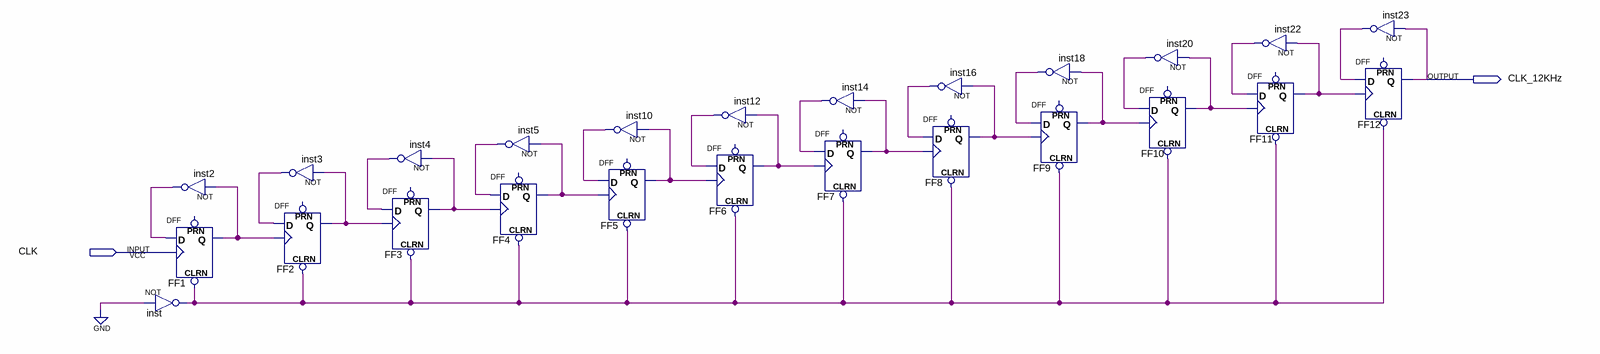
[diagram p0: schematic sheet]
// Quartus schematic CLK_12KHz.bdf as structural Verilog: 25 symbols, 2 pins
module CLK_12KHz (
  input  CLK,
  output CLK_12KHz
);

  wire FF1_q, FF2_q, FF3_q, FF4_q, FF5_q, FF6_q, FF7_q, FF8_q, FF9_q, FF10_q, FF11_q, inst2_out, inst3_out,
       inst4_out, inst5_out, inst10_out, inst12_out, inst14_out, inst16_out, inst18_out, inst20_out,
       inst22_out, inst23_out, inst_out;

  not inst (inst_out, 1'b0);
  not inst2 (inst2_out, FF1_q);
  DFF FF1 (.CLRN(inst_out), .CLK(CLK), .D(inst2_out), .Q(FF1_q));  // open: PRN
  not inst3 (inst3_out, FF2_q);
  DFF FF2 (.CLRN(inst_out), .CLK(FF1_q), .D(inst3_out), .Q(FF2_q));  // open: PRN
  not inst4 (inst4_out, FF3_q);
  DFF FF3 (.CLRN(inst_out), .CLK(FF2_q), .D(inst4_out), .Q(FF3_q));  // open: PRN
  DFF FF4 (.CLRN(inst_out), .CLK(FF3_q), .D(inst5_out), .Q(FF4_q));  // open: PRN
  not inst5 (inst5_out, FF4_q);
  not inst10 (inst10_out, FF5_q);
  DFF FF5 (.CLRN(inst_out), .CLK(FF4_q), .D(inst10_out), .Q(FF5_q));  // open: PRN
  not inst12 (inst12_out, FF6_q);
  DFF FF6 (.CLRN(inst_out), .CLK(FF5_q), .D(inst12_out), .Q(FF6_q));  // open: PRN
  not inst14 (inst14_out, FF7_q);
  DFF FF7 (.CLRN(inst_out), .CLK(FF6_q), .D(inst14_out), .Q(FF7_q));  // open: PRN
  not inst16 (inst16_out, FF8_q);
  DFF FF8 (.CLRN(inst_out), .CLK(FF7_q), .D(inst16_out), .Q(FF8_q));  // open: PRN
  not inst18 (inst18_out, FF9_q);
  DFF FF9 (.CLRN(inst_out), .CLK(FF8_q), .D(inst18_out), .Q(FF9_q));  // open: PRN
  not inst20 (inst20_out, FF10_q);
  DFF FF10 (.CLRN(inst_out), .CLK(FF9_q), .D(inst20_out), .Q(FF10_q));  // open: PRN
  not inst22 (inst22_out, FF11_q);
  DFF FF11 (.CLRN(inst_out), .CLK(FF10_q), .D(inst22_out), .Q(FF11_q));  // open: PRN
  DFF FF12 (.CLRN(inst_out), .CLK(FF11_q), .D(inst23_out), .Q(CLK_12KHz));  // open: PRN
  not inst23 (inst23_out, CLK_12KHz);
endmodule
